# EAGLE design LEMNOS3 (EAGLE 9.6.2)
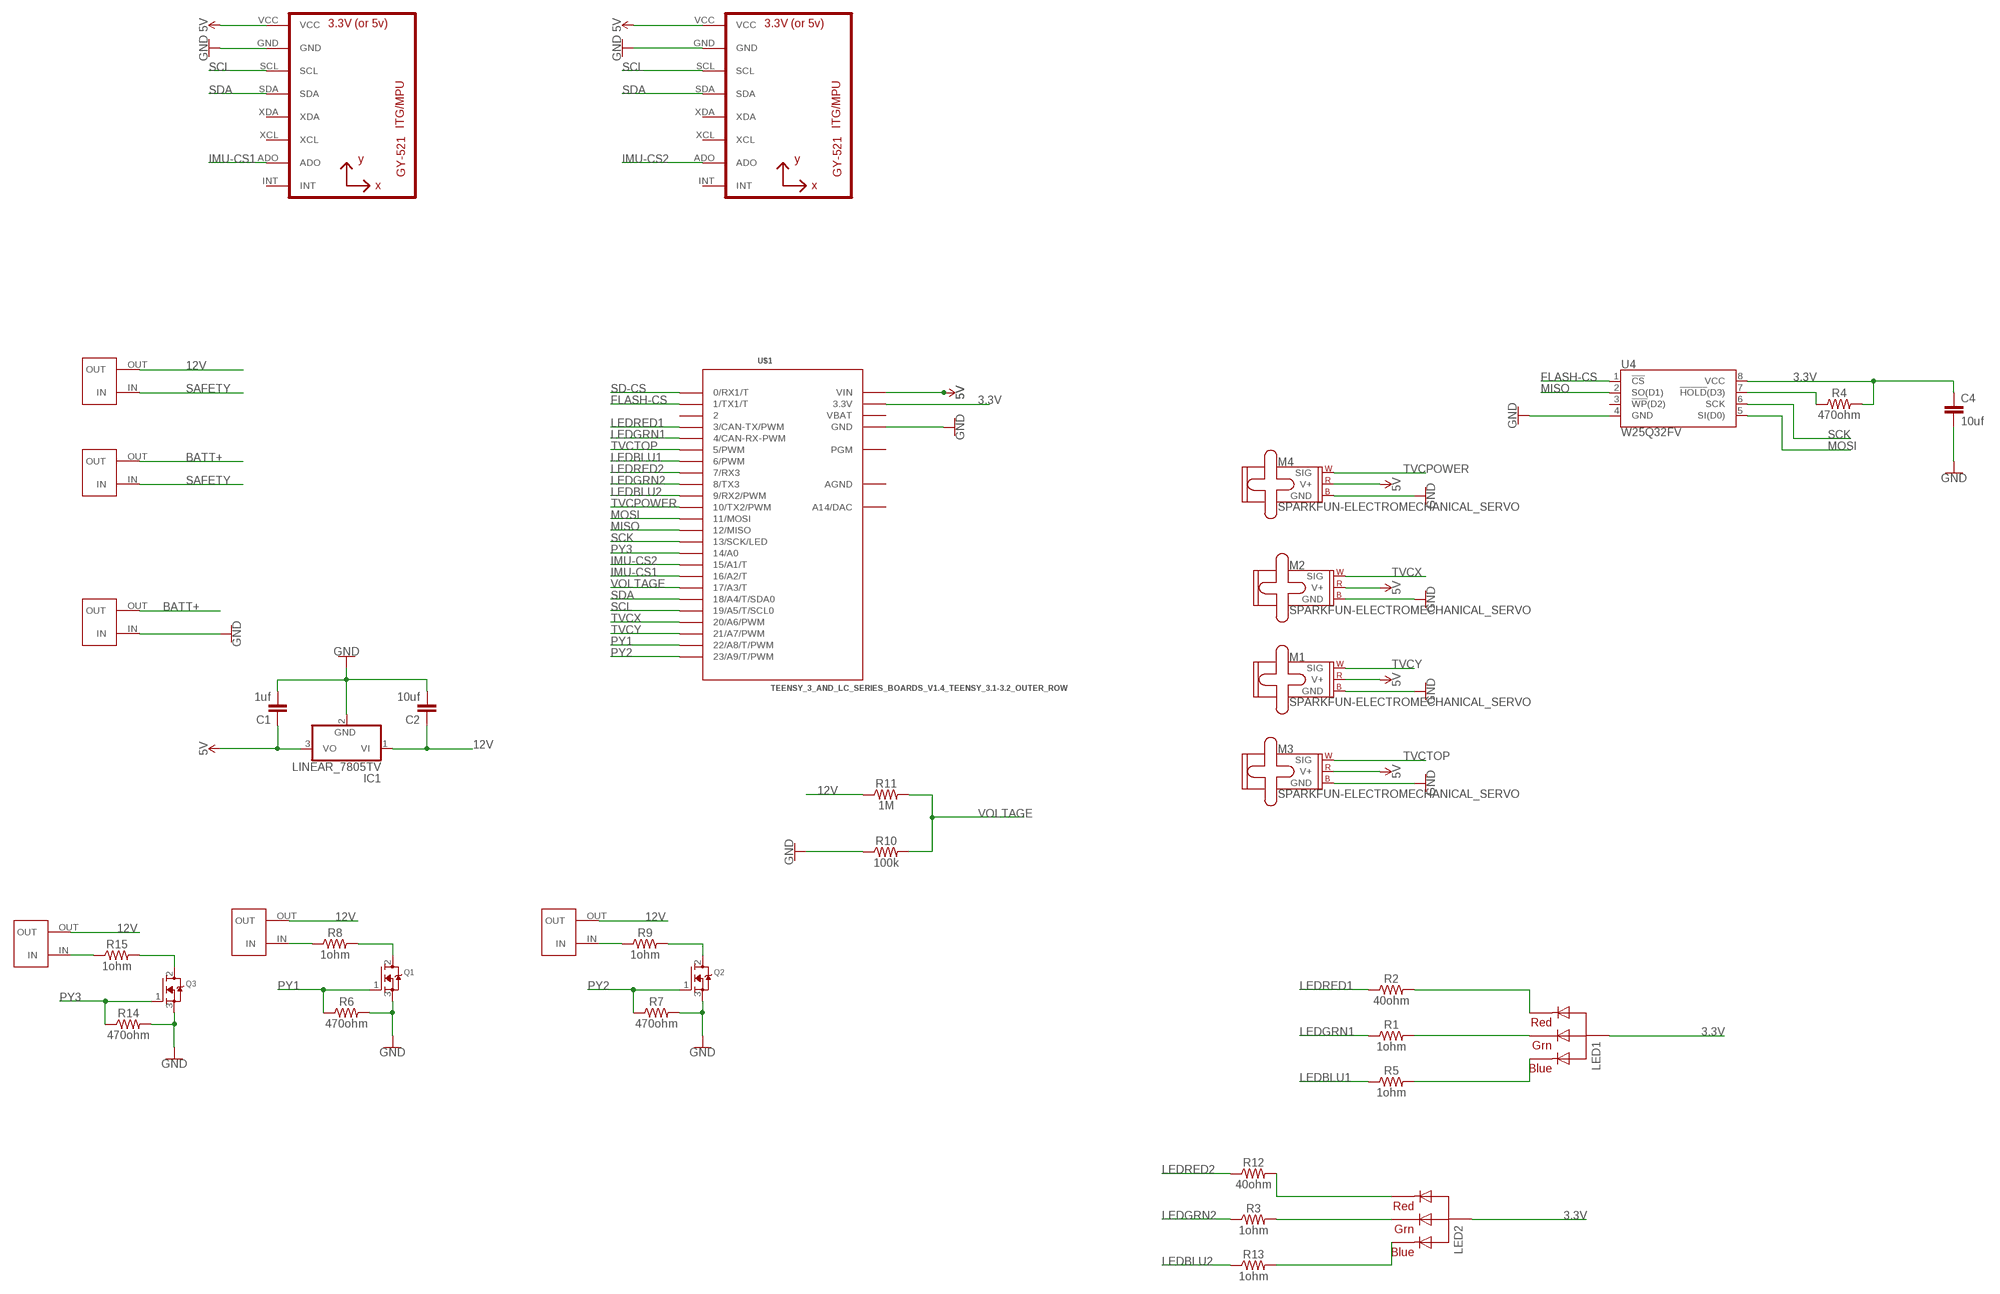
[diagram p0: schematic, sheet 1]

## Parts
C1  1uf  SPARKFUN-CAPACITORS_22PF-PTH-2.54MM-200V-5%  [SPARKFUN-CAPACITORS_CAP-PTH-2.54]
C2  10uf  SPARKFUN-CAPACITORS_22PF-PTH-2.54MM-200V-5%  [SPARKFUN-CAPACITORS_CAP-PTH-2.54]
C4  10uf  SPARKFUN-CAPACITORS_22PF-PTH-2.54MM-200V-5%  [SPARKFUN-CAPACITORS_CAP-PTH-2.54]
IC1  LINEAR_7805TV  [LINEAR_TO220V]
LED1  RGBLED_CA-5MM  [LED5MMRGB]
LED2  RGBLED_CA-5MM  [LED5MMRGB]
M1  SPARKFUN-ELECTROMECHANICAL_SERVO  [SPARKFUN-ELECTROMECHANICAL_1X03]
M2  SPARKFUN-ELECTROMECHANICAL_SERVO  [SPARKFUN-ELECTROMECHANICAL_1X03]
M3  SPARKFUN-ELECTROMECHANICAL_SERVO  [SPARKFUN-ELECTROMECHANICAL_1X03]
M4  SPARKFUN-ELECTROMECHANICAL_SERVO  [SPARKFUN-ELECTROMECHANICAL_1X03]
Q1  ADAFRUIT_MOSFET-NGDS_TO220V  [ADAFRUIT_TO220V]
Q2  ADAFRUIT_MOSFET-NGDS_TO220V  [ADAFRUIT_TO220V]
Q3  ADAFRUIT_MOSFET-NGDS_TO220V  [ADAFRUIT_TO220V]
R1  1ohm  SPARKFUN-RESISTORS_10MOHM-HORIZ-1/4W-5%  [SPARKFUN-RESISTORS_AXIAL-0.3]
R2  40ohm  SPARKFUN-RESISTORS_10MOHM-HORIZ-1/4W-5%  [SPARKFUN-RESISTORS_AXIAL-0.3]
R3  1ohm  SPARKFUN-RESISTORS_10MOHM-HORIZ-1/4W-5%  [SPARKFUN-RESISTORS_AXIAL-0.3]
R4  470ohm  SPARKFUN-RESISTORS_10MOHM-HORIZ-1/4W-5%  [SPARKFUN-RESISTORS_AXIAL-0.3]
R5  1ohm  SPARKFUN-RESISTORS_10MOHM-HORIZ-1/4W-5%  [SPARKFUN-RESISTORS_AXIAL-0.3]
R6  470ohm  SPARKFUN-RESISTORS_10MOHM-HORIZ-1/4W-5%  [SPARKFUN-RESISTORS_AXIAL-0.3]
R7  470ohm  SPARKFUN-RESISTORS_10MOHM-HORIZ-1/4W-5%  [SPARKFUN-RESISTORS_AXIAL-0.3]
R8  1ohm  SPARKFUN-RESISTORS_10MOHM-HORIZ-1/4W-5%  [SPARKFUN-RESISTORS_AXIAL-0.3]
R9  1ohm  SPARKFUN-RESISTORS_10MOHM-HORIZ-1/4W-5%  [SPARKFUN-RESISTORS_AXIAL-0.3]
R10  100k  SPARKFUN-RESISTORS_10MOHM-HORIZ-1/4W-5%  [SPARKFUN-RESISTORS_AXIAL-0.3]
R11  1M  SPARKFUN-RESISTORS_10MOHM-HORIZ-1/4W-5%  [SPARKFUN-RESISTORS_AXIAL-0.3]
R12  40ohm  SPARKFUN-RESISTORS_10MOHM-HORIZ-1/4W-5%  [SPARKFUN-RESISTORS_AXIAL-0.3]
R13  1ohm  SPARKFUN-RESISTORS_10MOHM-HORIZ-1/4W-5%  [SPARKFUN-RESISTORS_AXIAL-0.3]
R14  470ohm  SPARKFUN-RESISTORS_10MOHM-HORIZ-1/4W-5%  [SPARKFUN-RESISTORS_AXIAL-0.3]
R15  1ohm  SPARKFUN-RESISTORS_10MOHM-HORIZ-1/4W-5%  [SPARKFUN-RESISTORS_AXIAL-0.3]
U1  GY-521_GY-521MPU6050  [GY-521_GY-521]
U2  GY-521_GY-521MPU6050  [GY-521_GY-521]
U4  W25Q32FV  SPARKFUN-IC-MEMORY_W25Q32FVSS  [SPARKFUN-IC-MEMORY_SOIC-8]
U$1  TEENSY_3_AND_LC_SERIES_BOARDS_V1.4_TEENSY_3.1-3.2_OUTER_ROW  [TEENSY_3_AND_LC_SERIES_BOARDS_V1.4_TEENSY_3.0-3.2&LC_OUTER_ROW]
U$2  BLACKTERMBLOCK_BLACKTERMBLOCK  [BLACKTERMBLOCK_BLACKTERMBLOCK]
U$3  BLACKTERMBLOCK_BLACKTERMBLOCK  [BLACKTERMBLOCK_BLACKTERMBLOCK]
U$4  BLACKTERMBLOCK_BLACKTERMBLOCK  [BLACKTERMBLOCK_BLACKTERMBLOCK]
U$5  BLACKTERMBLOCK_BLACKTERMBLOCK  [BLACKTERMBLOCK_BLACKTERMBLOCK]
U$6  BLACKTERMBLOCK_BLACKTERMBLOCK  [BLACKTERMBLOCK_BLACKTERMBLOCK]
U$8  BLACKTERMBLOCK_BLACKTERMBLOCK  [BLACKTERMBLOCK_BLACKTERMBLOCK]

## Nets
3.3V: C4.1 LED1.2(VCC) LED2.2(VCC) R4.P$2 U4.8(VCC) U$1.3.3V U$1.3.3V1(3.3V)
5V: C1.1 IC1.3(VO) M1.2(V+) M2.2(V+) M3.2(V+) M4.2(V+) U1.VCC U2.VCC U$1.VIN
12V: C2.1 IC1.1(VI) R11.P$1 U$2.OUT U$5.OUT U$6.OUT U$8.OUT
BATT+: U$3.OUT U$4.OUT
FLASH-CS: U4.1(!CS!) U$1.1(1/TX1/T)
GND: C1.2 C2.2 C4.2 IC1.2(GND) M1.3(GND) M2.3(GND) M3.3(GND) M4.3(GND) Q1.3(S) Q2.3(S) Q3.3(S) R6.P$2 R7.P$2 R10.P$1 R14.P$2 U1.GND U2.GND U4.4(GND) U$1.GND U$1.GND1(GND) U$3.IN
IMU-CS1: U1.ADO U$1.16/A2(16/A2/T)
IMU-CS2: U2.ADO U$1.15/A1(15/A1/T)
LEDBLU1: R5.P$1 U$1.6(6/PWM)
LEDBLU2: R13.P$1 U$1.9(9/RX2/PWM)
LEDGRN1: R1.P$1 U$1.4(4/CAN-RX-PWM)
LEDGRN2: R3.P$1 U$1.8(8/TX3)
LEDRED1: R2.P$1 U$1.3(3/CAN-TX/PWM)
LEDRED2: R12.P$1 U$1.7(7/RX3)
MISO: U4.2(SO(D1)) U$1.12(12/MISO)
MOSI: U4.5(SI(D0)) U$1.11(11/MOSI)
N$1: R15.P$1 U$2.IN
N$2: LED1.1(RED) R2.P$2
N$3: R4.P$1 U4.7(!HOLD!(D3))
N$4: LED1.3(GREEN) R1.P$2
N$5: LED1.4(BLUE) R5.P$2
N$6: R8.P$1 U$5.IN
N$7: Q1.2(D) R8.P$2
N$8: LED2.1(RED) R12.P$2
N$9: R9.P$1 U$6.IN
N$10: Q2.2(D) R9.P$2
N$11: LED2.3(GREEN) R3.P$2
N$12: LED2.4(BLUE) R13.P$2
N$13: Q3.2(D) R15.P$2
PY1: Q1.1(G) R6.P$1 U$1.22/A8(22/A8/T/PWM)
PY2: Q2.1(G) R7.P$1 U$1.23/A9(23/A9/T/PWM)
PY3: Q3.1(G) R14.P$1 U$1.14/A0
SAFETY: U$4.IN U$8.IN
SCK: U4.6(SCK) U$1.13(13/SCK/LED)
SCL: U1.SCL U2.SCL U$1.19/A5(19/A5/T/SCL0)
SD-CS: U$1.0(0/RX1/T)
SDA: U1.SDA U2.SDA U$1.18/A4(18/A4/T/SDA0)
TVCPOWER: M4.1(SIG) U$1.10(10/TX2/PWM)
TVCTOP: M3.1(SIG) U$1.5(5/PWM)
TVCX: M2.1(SIG) U$1.20/A6(20/A6/PWM)
TVCY: M1.1(SIG) U$1.21/A7(21/A7/PWM)
VOLTAGE: R10.P$2 R11.P$2 U$1.17/A3(17/A3/T)
Unconnected: U1.INT U1.XCL U1.XDA U2.INT U2.XCL U2.XDA U4.3(!WP!(D2)) U$1.2 U$1.PGM U$1.RESET/DAC(A14/DAC)

## Power pins joined to a net without a drawn wire
AGND: U$1.AGND
VBAT: U$1.VBAT

## Library data of the parts
C1 C2 C4 = Blip V1:SPARKFUN-CAPACITORS_22PF: 22pF ceramic capacitors A capacitor is a passive two-terminal electrical component used to store electrical energy temporarily in an electric field.; PROD_ID: CAP-09128; VALUE: 22pF
IC1 = Blip V1:LINEAR_78*: Positive VOLTAGE REGULATOR Source: http://cache.national.com/ds/LM/LM78L05.pdf http://www.fairchildsemi.com/ds/LM/LM7805.pdf
LED1 LED2 = adafruit:RGBLED_CA: RGB LED, common-anode 5MM Staggered pins 5mm Piranha package http://www.ladyada.net/library/pcb/eaglelibrary.html
M1-M4 = Blip V1:SPARKFUN-ELECTROMECHANICAL_SERVO: Servo Motor 3-pin connector for a standard servo motor (voltage supply, ground, and control signal.) SparkFun Products Servo - Generic (Sub-Micro Size) <https://www.sparkfun.com/products/9065> (ROB-09065) Servo - Generic High Torque Continuous Rotation (Standard Size) <https://www.sparkfun.com/products/9347> (ROB-09347) Servo - Generic High Torque (Standard Size) <https://www.sparkfun.com/products/11965> (ROB-11965)
Q1-Q3 = Blip V1:ADAFRUIT_MOSFET-N: N-Channel Mosfet 2N7002E - 60V 260mA SOT23 [Digikey: 2N7002ET1GOSTR-ND] - REEL BSH103 - 30V 850mA SOT23 [Digikey: 568-5013-1-ND]
R1-R15 = Blip V1:SPARKFUN-RESISTORS_10MOHM: RES-09327; PROD_ID: RES-09327; VALUE: 10M
U1 U2 = Blip V1:GY-521_GY-521
U4 = Blip V1:SPARKFUN-IC-MEMORY_W25Q32FV: W25Q32FV 32Mb (4MB) Serial Flash Memory The W25Q32FV support the standard Serial Peripheral Interface (SPI), Dual/Quad I/O SPI as well as 2-clocks instruction cycle Quad Peripheral Interface (QPI). 104MHz, SPI, 8-SOIC-EIAJ Datasheet <http://www.winbond.com/resource-files/w25q32fv%20revh%20091613.pdf> SparkFun Products SparkFun Blynk Board - ESP8266 <https://www.sparkfun.com/products/13794> (WRL-13794); PROD_ID: IC-13229
U$1 = Blip V1:TEENSY_3_AND_LC_SERIES_BOARDS_V1.4_TEENSY_3.1-3.2_OUTER_ROW: Footprint for Teensy 3.1 or 3.2 board using all pin connections on the outer perimeter
U$2-U$6 U$8 = Blip V1:BLACKTERMBLOCK_BLACKTERMBLOCK

## Board
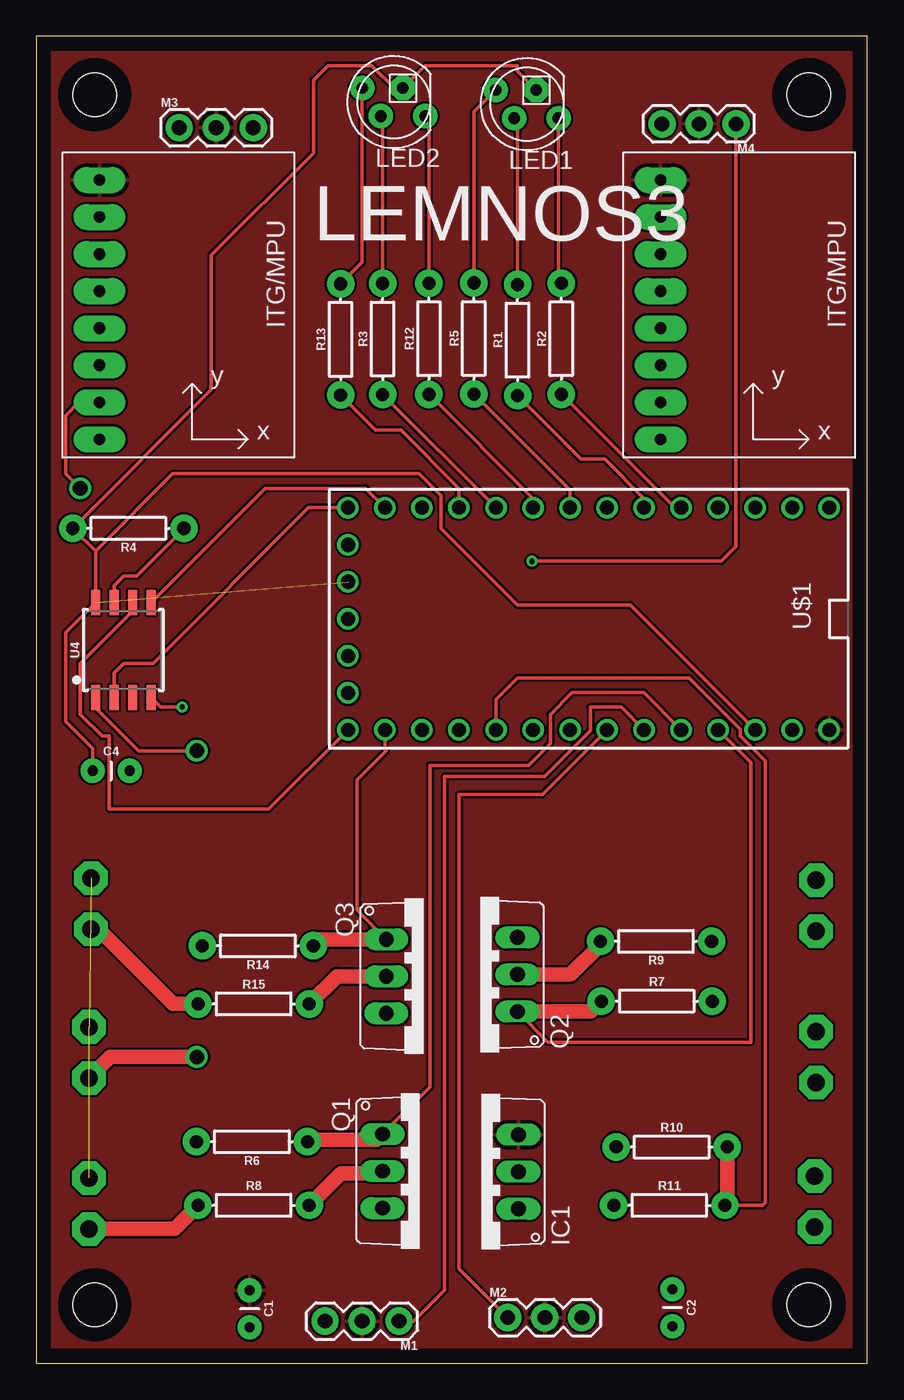
[diagram p1: board, top side]
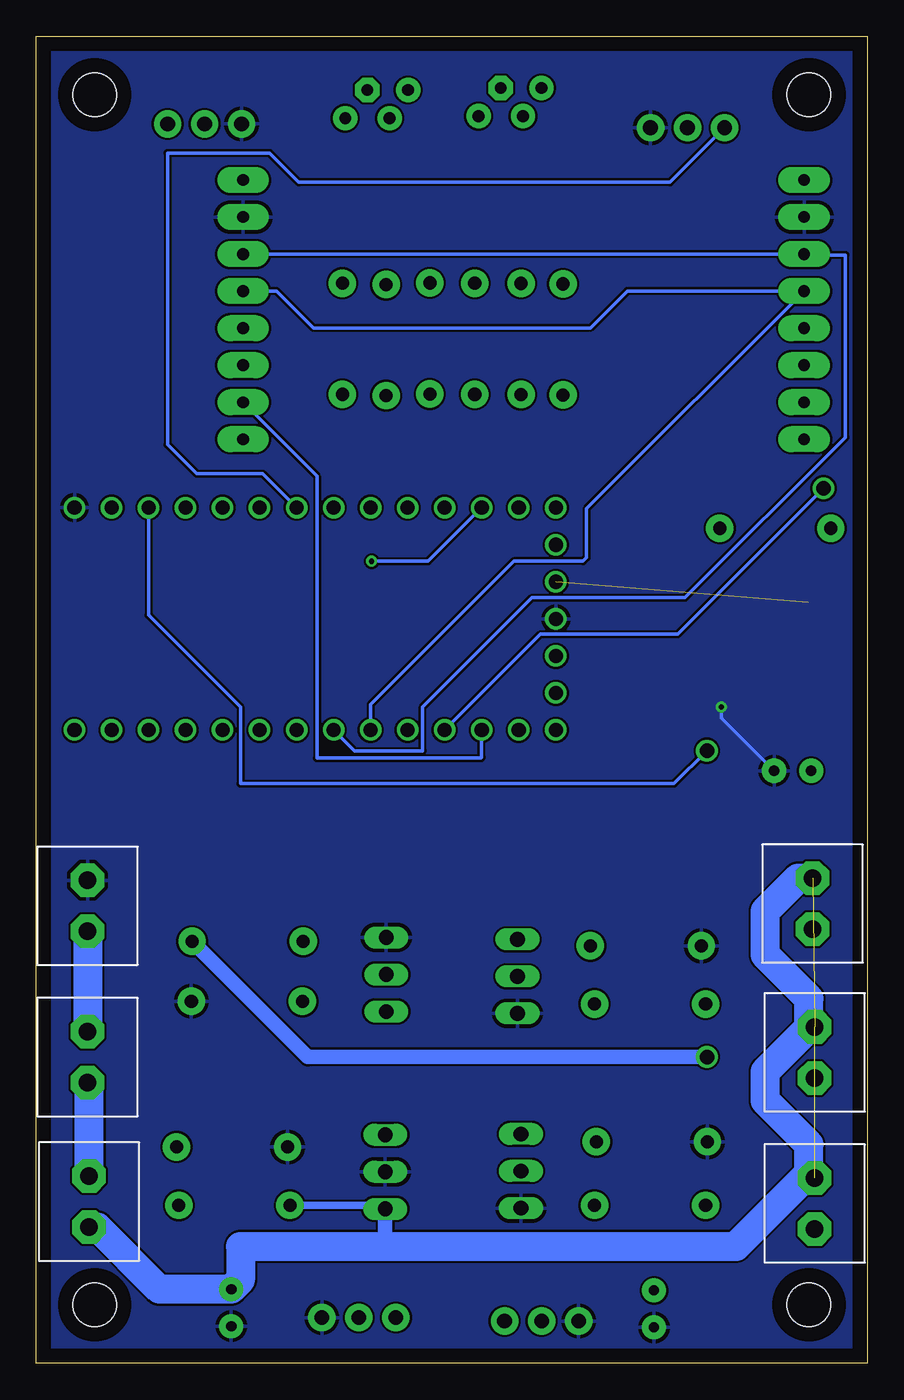
[diagram p2: board, bottom side, seen from below]

Size 57 x 91 mm. Coordinates in mm from the lower left corner, seen from the top.
Outline: 0,0 57,0 57,91 0,91 0,0
Copper layers (1*16): Top 0.035mm / dielectric 1.5mm / Bottom 0.035mm
Design rules "default": minimum track width 6mil, minimum drill 0.35mm, track to track 6mil, track to pad 6mil, pad to pad 6mil, via to via 6mil, smd to smd 6mil, copper to edge 40mil, drill to drill 6mil, minimum pad ring 10mil, minimum via ring 8mil, stop-mask expansion 4mil, vias tented up to drill 0mil, thermal gap 10mil
Holes 3 mm at 4,4 53,4 4,87 53,87

### Footprints (pad centres in the part's own frame; a part is rotated, then mirrored left to right if it is on the bottom)
SPARKFUN-CAPACITORS_CAP-PTH-2.54 = drill 0.7 pad 1.651: 1 -1.27,0; 2 1.27,0
LINEAR_TO220V = drill 1.016 long: 1 -2.54,-2.54; 2 0,-2.54; 3 2.54,-2.54
LED5MMRGB = drill 0.8 pad 1.676: 1 -2.159,0.968; 3 0.889,0.968; 4 2.159,-0.968 | drill 0.8 pad 1.676 octagon: 2 -0.635,-0.968
SPARKFUN-ELECTROMECHANICAL_1X03 = drill 1.016 pad 1.88: 1 0,0; 2 2.54,0; 3 5.08,0
ADAFRUIT_TO220V = drill 1.016 long: 1 -2.54,-2.54; 2 0,-2.54; 3 2.54,-2.54
SPARKFUN-RESISTORS_AXIAL-0.3 = drill 0.9 pad 1.88: P$1 -3.81,0; P$2 3.81,0
GY-521_GY-521 = drill 0.8 pad 1.778 long: ADO -8.89,-6.35; GND -8.89,6.35; INT -8.89,-8.89; SCL -8.89,3.81; SDA -8.89,1.27; VCC -8.89,8.89; XCL -8.89,-3.81; XDA -8.89,-1.27
SPARKFUN-IC-MEMORY_SOIC-8 = smd 0.61 x 1.702: 1 -1.905,-3.251; 2 -0.635,-3.251; 3 0.635,-3.251; 4 1.905,-3.251; 5 1.905,3.251; 6 0.635,3.251; 7 -0.635,3.251; 8 -1.905,3.251
TEENSY_3_AND_LC_SERIES_BOARDS_V1.4_TEENSY_3.0-3.2&LC_OUTER_ROW = drill 0.965: 0 -7.62,13.97; 1 -7.62,11.43; 2 -7.62,8.89; 3 -7.62,6.35; 3.3V 7.62,11.43; 3.3V1 -2.54,-16.51; 4 -7.62,3.81; 5 -7.62,1.27; 6 -7.62,-1.27; 7 -7.62,-3.81; 8 -7.62,-6.35; 9 -7.62,-8.89; 10 -7.62,-11.43; 11 -7.62,-13.97; 12 -7.62,-16.51; 13 7.62,-16.51; 14/A0 7.62,-13.97; 15/A1 7.62,-11.43; 16/A2 7.62,-8.89; 17/A3 7.62,-6.35; 18/A4 7.62,-3.81; 19/A5 7.62,-1.27; 20/A6 7.62,1.27; 21/A7 7.62,3.81; 22/A8 7.62,6.35; 23/A9 7.62,8.89; AGND 7.62,13.97; GND -7.62,16.51; GND1 0,-16.51; PGM 2.54,-16.51; RESET/DAC 5.08,-16.51; VBAT -5.08,-16.51; VIN 7.62,16.51
BLACKTERMBLOCK_BLACKTERMBLOCK = drill 1.2 pad 2.3 octagon: IN 0,0; OUT 3.5,0

### Placement (x,y rotation side)
C1  14.63,3.72 270 top
C2  43.63,3.8 270 top
C4  5.12,40.63 0 top
IC1  30.53,13.12 90 top
LED1  33.66,86.36 180 top
LED2  24.51,86.5 180 top
M1  24.88,2.88 180 top
M2  32.34,3.12 0 top
M3  9.79,84.74 0 top
M4  48,85 180 top
Q1  26.29,13.17 270 top
Q2  30.46,26.65 90 top
Q3  26.54,26.53 270 top
R1  33.01,70.17 90 top
R2  36.01,70.26 90 top
R3  23.75,70.25 90 top
R4  6.31,57.26 180 top
R5  30.01,70.28 90 top
R6  14.78,15.18 180 top
R7  42.56,24.82 0 top
R8  14.9,10.82 0 top
R9  42.51,28.93 180 top
R10  43.58,14.82 0 top
R11  43.42,10.82 0 top
R12  26.93,70.26 90 top
R13  20.87,70.22 90 top
R14  15.19,28.62 180 top
R15  14.9,24.63 0 top
U1  13.22,72.26 0 top
U2  51.71,72.26 0 top
U4  5.96,48.91 0 top
U$1  37.88,51.05 270 top
U$2  3.75,29.77 90 top
U$3  53.5,33.12 270 top
U$4  53.5,19.24 90 top
U$5  3.61,9.2 90 top
U$6  3.61,19.56 90 top
U$8  53.39,12.83 270 top

### Tracks (layer width: path | path; a pad name or v marks a point on that pad's centre or on a via)
3.3V  (1 unrouted)
  Top 0.25: LED1.2 33,88.62 33,89 26.68,89 LED2.2 24.53,87.47 23,89 20,89 19,88 19,83 12,76 12,66.76 R4.P$2 4.05,55.7 | 4.05,55.7 U4.8 2,50.11 2,44 3.85,42.15 C4.1 | 4.05,55.7 9.35,61 26.25,61 27.75,59.5 27.75,57.25 33,52 40.74,52 U$1.3.3V
5V
  pour Top: -3,98 60,98 66,92 66,-5 64,-7 -3,-7 -6,-4 -6,95
12V  (2 unrouted)
  Bottom 0.5: R11.P$1 33.31,10.82 IC1.1
  Bottom 1: IC1.1 33.07,8.07 33,8
  Bottom 2: U$8.OUT 52.83,9.33 48.57,5.07 C2.1 43,5.7 43,8 33,8 9,8 4,13 4,15 7,18 7,20 4,23 4,25 7,28 7,31 4.73,33.27 U$2.OUT
BATT+
  Bottom 2: U$3.OUT U$4.OUT
FLASH-CS  (via drill 1)
  Top 0.25: v11,42 7,42 4,45 4,45.6 U4.1
  Bottom 0.25: U$1.1 49.31,51.31 43,45 43,39.75 13.25,39.75 v11,42
GND  (via drill 0.35)
  Top 0.25: v10,45 8.52,45 U4.4
  Bottom 0.25: C4.2 10,44.24 v10,45
  pour Bottom: -4,96 64,96 70,90 70,3 59,-8 57,-10 -2,-10 -9,-3 -9,93 -6,96
IMU-CS1  (via drill 1)
  Top 0.25: v3,60 2,61 2,65 2.91,65.91 U1.ADO
  Bottom 0.25: U$1.16/A2 22.42,50 13,50 v3,60
IMU-CS2
  Bottom 0.25: U2.ADO 37.75,60.84 37.75,41.5 26.5,41.5 26.45,41.55 U$1.15/A1
LEDBLU1
  Top 0.25: R5.P$1 36.61,59.87 U$1.6
LEDBLU2
  Top 0.25: 28.61,58.67 U$1.9 28.99,59.99 29,60 25,64 23.28,64 R13.P$1
LEDGRN1
  Top 0.25: U$1.4 41.69,59.31 39,62 37.37,62 R1.P$1
LEDGRN2
  Top 0.25: R3.P$1 U$1.8
LEDRED1
  Top 0.25: R2.P$1 43.79,58.67 U$1.3
LEDRED2
  Top 0.25: R12.P$1 34.07,59.31 U$1.7
MISO
  Top 0.25: U$1.12 18.67,58.67 8,48 6,48 5.33,47.33 U4.2
MOSI
  Top 0.25: U$1.11 22.58,60 15.7,60 U4.5
N$1
  Top 1: R15.P$1 9.37,24.63 4.23,29.77 U$2.IN
N$2
  Top 0.25: R2.P$2 35.82,74.26 LED1.1
N$3
  Top 0.25: R4.P$1 6.86,54 6,54 5.33,53.33 U4.7
N$4
  Top 0.25: LED1.3 33.01,85.15 R1.P$2
N$5
  Top 0.25: R5.P$2 30.01,85.84 LED1.4
N$6
  Top 1: U$5.IN 9.47,9.2 R8.P$1
N$7
  Top 1: R8.P$2 20.89,13 23.58,13 Q1.2
N$8
  Top 0.25: R12.P$2 26.93,85.27 LED2.1
N$9  (via drill 1)
  Top 1: U$6.IN 5.05,21 v11,21 | 45.93,28.93 R9.P$1
  Bottom 1: v11,21 38.39,21 R9.P$1
N$10
  Top 1: Q2.2 36.65,26.65 38.7,28.7 R9.P$2
N$11
  Top 0.25: LED2.3 23.75,85.4 R3.P$2
N$12
  Top 0.25: LED2.4 22.35,75.51 R13.P$2
N$13
  Top 1: R15.P$2 20.61,26.53 Q3.2
PY1
  Top 0.25: U$1.22/A8 41.66,46 36.75,46 35.25,44.5 35.25,42.5 33.75,41 27,41 27,18.96 Q1.1 | R6.P$1 18.7,15.29
  Top 1: Q1.1 23.34,15.29 18.7,15.29
PY2
  Top 0.25: U$1.23/A9 49,41.2 49,22 35.11,22 Q2.1
  Top 1: Q2.1 38.04,24.11 R7.P$1
PY3
  Top 0.25: Q3.1 22,31.07 22,40 24,42 23.91,42.09 U$1.14/A0
  Top 1: R14.P$1 19.45,29.07 Q3.1
SAFETY
  Bottom 2: U$8.IN 53.39,19.13 U$4.IN
SCK
  Top 0.25: U4.6 6.59,51.59 3,48 3,44.5 4.5,43 5,43 5,38 15.94,38 U$1.13
SCL
  Bottom 0.25: U2.SCL U1.SCL 4.26,76 1.5,76 1.5,63.5 12.5,52.5 23,52.5 30.5,45 30.5,42 35.18,42 U$1.19/A5
SDA
  Bottom 0.25: U2.SDA 40.53,73.53 38,71 19,71 16.47,73.53 U1.SDA 19.25,58.61 19.25,55.25 19.5,55 24.25,55 34.07,45.18 U$1.18/A4
TVCPOWER  (via drill 0.35)
  Top 0.25: M4.1 48,56 47,55 v34,55
  Bottom 0.25: v34,55 30.12,55 U$1.10
TVCTOP
  Bottom 0.25: M3.1 13.53,81 39,81 41,83 48,83 48,63 46,61 41.48,61 U$1.5
TVCX
  Top 0.25: U$1.20/A6 34.72,39 29,39 29,6.46 M2.1
TVCY
  Top 0.25: U$1.21/A7 40.12,45 38,45 38,43.39 34.86,40.25 28,40.25 28,5 25.88,2.88 M1.1
VOLTAGE
  Top 0.25: R11.P$2 49.82,10.82 50,11 50,41.31 48.3,43.01 48.3,43.45 44.75,47 33,47 31.53,45.53 U$1.17/A3
  Top 1: R10.P$2 47.39,10.98 R11.P$2

### Text on the board
tNames: LEMNOS3